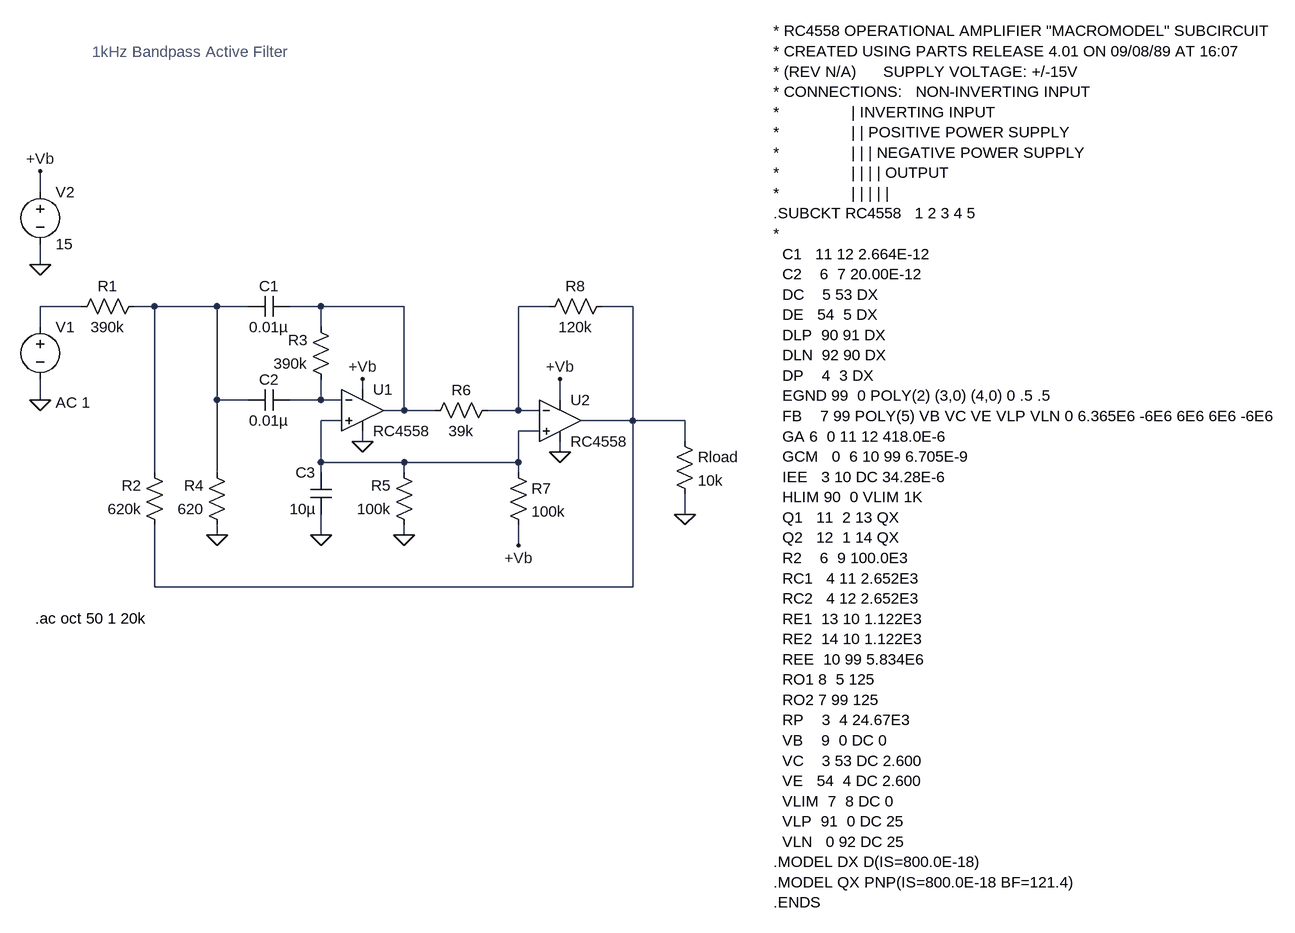
[diagram p0: schematic RC4558 Example.asc]
RC4558 Example.asc, the LTspice schematic file:
Version 4
SHEET 1 1776 876
WIRE -224 -96 -224 -128
WIRE -224 16 -224 -16
WIRE -160 80 -224 80
WIRE -48 80 -80 80
WIRE 48 80 -48 80
WIRE 96 80 48 80
WIRE 208 80 160 80
WIRE 336 80 208 80
WIRE 560 80 512 80
WIRE 688 80 640 80
WIRE -224 112 -224 80
WIRE 208 112 208 80
WIRE 272 208 272 192
WIRE -224 224 -224 192
WIRE 48 224 48 80
WIRE 96 224 48 224
WIRE 208 224 208 192
WIRE 208 224 160 224
WIRE 240 224 208 224
WIRE 576 224 576 192
WIRE 336 240 336 80
WIRE 336 240 304 240
WIRE 384 240 336 240
WIRE 512 240 512 80
WIRE 512 240 464 240
WIRE 544 240 512 240
WIRE 240 256 208 256
WIRE 688 256 688 80
WIRE 688 256 608 256
WIRE 768 256 688 256
WIRE 544 272 512 272
WIRE 272 288 272 272
WIRE 768 288 768 256
WIRE 576 304 576 288
WIRE 208 320 208 256
WIRE 336 320 208 320
WIRE 512 320 512 272
WIRE 512 320 336 320
WIRE -48 336 -48 80
WIRE 48 336 48 224
WIRE 208 336 208 320
WIRE 336 336 336 320
WIRE 512 336 512 320
WIRE 768 400 768 368
WIRE 48 432 48 416
WIRE 208 432 208 400
WIRE 336 432 336 416
WIRE 512 448 512 416
WIRE -48 512 -48 416
WIRE 688 512 688 256
WIRE 688 512 -48 512
FLAG 48 432 0
FLAG 208 432 0
FLAG 336 432 0
FLAG 576 304 0
FLAG 272 288 0
FLAG -224 224 0
FLAG -224 16 0
FLAG 272 192 +Vb
FLAG 576 192 +Vb
FLAG 512 448 +Vb
FLAG -224 -128 +Vb
FLAG 768 400 0
SYMBOL Opamps\\opamp2 272 176 R0
SYMATTR InstName U1
SYMATTR Value RC4558
SYMBOL Opamps\\opamp2 576 192 R0
SYMATTR InstName U2
SYMATTR Value RC4558
SYMBOL res -64 64 R90
WINDOW 0 0 56 VBottom 0
WINDOW 3 32 56 VTop 0
SYMATTR InstName R1
SYMATTR Value 390k
SYMBOL res -32 432 R180
WINDOW 0 36 76 Left 0
WINDOW 3 36 40 Left 0
SYMATTR InstName R2
SYMATTR Value 620k
SYMBOL res 224 208 R180
WINDOW 0 36 76 Left 0
WINDOW 3 36 40 Left 0
SYMATTR InstName R3
SYMATTR Value 390k
SYMBOL res 64 432 R180
WINDOW 0 36 76 Left 0
WINDOW 3 36 40 Left 0
SYMATTR InstName R4
SYMATTR Value 620
SYMBOL res 352 432 R180
WINDOW 0 36 76 Left 0
WINDOW 3 36 40 Left 0
SYMATTR InstName R5
SYMATTR Value 100k
SYMBOL res 368 256 R270
WINDOW 0 32 56 VTop 0
WINDOW 3 0 56 VBottom 0
SYMATTR InstName R6
SYMATTR Value 39k
SYMBOL res 496 320 R0
SYMATTR InstName R7
SYMATTR Value 100k
SYMBOL res 656 64 R90
WINDOW 0 0 56 VBottom 0
WINDOW 3 32 56 VTop 0
SYMATTR InstName R8
SYMATTR Value 120k
SYMBOL cap 160 64 R90
WINDOW 0 0 32 VBottom 0
WINDOW 3 32 32 VTop 0
SYMATTR InstName C1
SYMATTR Value 0.01µ
SYMATTR SpiceLine V=50 Irms=0 Rser=0.0355 Lser=750p mfg="Yageo" pn="CC0603KRX7R9BB103" type="X7R"
SYMBOL cap 160 208 R90
WINDOW 0 0 32 VBottom 0
WINDOW 3 32 32 VTop 0
SYMATTR InstName C2
SYMATTR Value 0.01µ
SYMATTR SpiceLine V=50 Irms=0 Rser=0.0355 Lser=750p mfg="Yageo" pn="CC0603KRX7R9BB103" type="X7R"
SYMBOL cap 224 400 R180
WINDOW 0 24 64 Left 0
WINDOW 3 24 8 Left 0
SYMATTR InstName C3
SYMATTR Value 10µ
SYMATTR SpiceLine V=35 Irms=630m Rser=0.3 Lser=0 mfg="NIC" pn="NTC-L106M35TRD" type="Low ESR Tantalum"
SYMBOL voltage -224 96 R0
WINDOW 123 24 132 Left 0
WINDOW 39 0 0 Left 0
SYMATTR InstName V1
SYMATTR Value ""
SYMATTR Value2 AC 1
SYMBOL voltage -224 -112 R0
WINDOW 123 0 0 Left 0
WINDOW 39 0 0 Left 0
SYMATTR InstName V2
SYMATTR Value 15
SYMBOL res 752 272 R0
SYMATTR InstName Rload
SYMATTR Value 10k
TEXT -232 560 Left 0 !.ac oct 50 1 20k
TEXT 904 -344 Left 0 !* RC4558 OPERATIONAL AMPLIFIER "MACROMODEL" SUBCIRCUIT\n* CREATED USING PARTS RELEASE 4.01 ON 09/08/89 AT 16:07\n* (REV N/A)      SUPPLY VOLTAGE: +/-15V\n* CONNECTIONS:   NON-INVERTING INPUT\n*                | INVERTING INPUT\n*                | | POSITIVE POWER SUPPLY\n*                | | | NEGATIVE POWER SUPPLY\n*                | | | | OUTPUT\n*                | | | | |\n.SUBCKT RC4558   1 2 3 4 5\n*\n  C1   11 12 2.664E-12\n  C2    6  7 20.00E-12\n  DC    5 53 DX\n  DE   54  5 DX\n  DLP  90 91 DX\n  DLN  92 90 DX\n  DP    4  3 DX\n  EGND 99  0 POLY(2) (3,0) (4,0) 0 .5 .5\n  FB    7 99 POLY(5) VB VC VE VLP VLN 0 6.365E6 -6E6 6E6 6E6 -6E6\n  GA 6  0 11 12 418.0E-6\n  GCM   0  6 10 99 6.705E-9\n  IEE   3 10 DC 34.28E-6\n  HLIM 90  0 VLIM 1K\n  Q1   11  2 13 QX\n  Q2   12  1 14 QX\n  R2    6  9 100.0E3\n  RC1   4 11 2.652E3\n  RC2   4 12 2.652E3\n  RE1  13 10 1.122E3\n  RE2  14 10 1.122E3\n  REE  10 99 5.834E6\n  RO1 8  5 125\n  RO2 7 99 125\n  RP    3  4 24.67E3\n  VB    9  0 DC 0\n  VC    3 53 DC 2.600\n  VE   54  4 DC 2.600\n  VLIM  7  8 DC 0\n  VLP  91  0 DC 25\n  VLN   0 92 DC 25\n.MODEL DX D(IS=800.0E-18)\n.MODEL QX PNP(IS=800.0E-18 BF=121.4)\n.ENDS
TEXT -144 -312 Left 0 ;1kHz Bandpass Active Filter

The netlist it stands for:
* RC4558 Example.asc
XU1 N007 N006 +Vb 0 N003 RC4558  ; pins In+ In- V+ V- OUT
XU2 N007 N004 +Vb 0 N005 RC4558  ; pins In+ In- V+ V- OUT
R1 N002 N001 390k
R2 N005 N002 620k
R3 N006 N003 390k
R4 0 N002 620
R5 0 N007 100k
R6 N003 N004 39k
R7 N007 +Vb 100k
R8 N005 N004 120k
C1 N003 N002 0.01µ V=50 Irms=0 Rser=0.0355 Lser=750p mfg="Yageo" pn="CC0603KRX7R9BB103" type="X7R"
C2 N006 N002 0.01µ V=50 Irms=0 Rser=0.0355 Lser=750p mfg="Yageo" pn="CC0603KRX7R9BB103" type="X7R"
C3 0 N007 10µ V=35 Irms=630m Rser=0.3 Lser=0 mfg="NIC" pn="NTC-L106M35TRD" type="Low ESR Tantalum"
V1 N001 0 AC 1
V2 +Vb 0 15
Rload N005 0 10k
.ac oct 50 1 20k
* RC4558 OPERATIONAL AMPLIFIER "MACROMODEL" SUBCIRCUIT
* CREATED USING PARTS RELEASE 4.01 ON 09/08/89 AT 16:07
* (REV N/A)      SUPPLY VOLTAGE: +/-15V
* CONNECTIONS:   NON-INVERTING INPUT
*                | INVERTING INPUT
*                | | POSITIVE POWER SUPPLY
*                | | | NEGATIVE POWER SUPPLY
*                | | | | OUTPUT
*                | | | | |
.SUBCKT RC4558   1 2 3 4 5
*
  C1   11 12 2.664E-12
  C2    6  7 20.00E-12
  DC    5 53 DX
  DE   54  5 DX
  DLP  90 91 DX
  DLN  92 90 DX
  DP    4  3 DX
  EGND 99  0 POLY(2) (3,0) (4,0) 0 .5 .5
  FB    7 99 POLY(5) VB VC VE VLP VLN 0 6.365E6 -6E6 6E6 6E6 -6E6
  GA 6  0 11 12 418.0E-6
  GCM   0  6 10 99 6.705E-9
  IEE   3 10 DC 34.28E-6
  HLIM 90  0 VLIM 1K
  Q1   11  2 13 QX
  Q2   12  1 14 QX
  R2    6  9 100.0E3
  RC1   4 11 2.652E3
  RC2   4 12 2.652E3
  RE1  13 10 1.122E3
  RE2  14 10 1.122E3
  REE  10 99 5.834E6
  RO1 8  5 125
  RO2 7 99 125
  RP    3  4 24.67E3
  VB    9  0 DC 0
  VC    3 53 DC 2.600
  VE   54  4 DC 2.600
  VLIM  7  8 DC 0
  VLP  91  0 DC 25
  VLN   0 92 DC 25
.MODEL DX D(IS=800.0E-18)
.MODEL QX PNP(IS=800.0E-18 BF=121.4)
.ENDS
* 1kHz Bandpass Active Filter
.backanno
.end